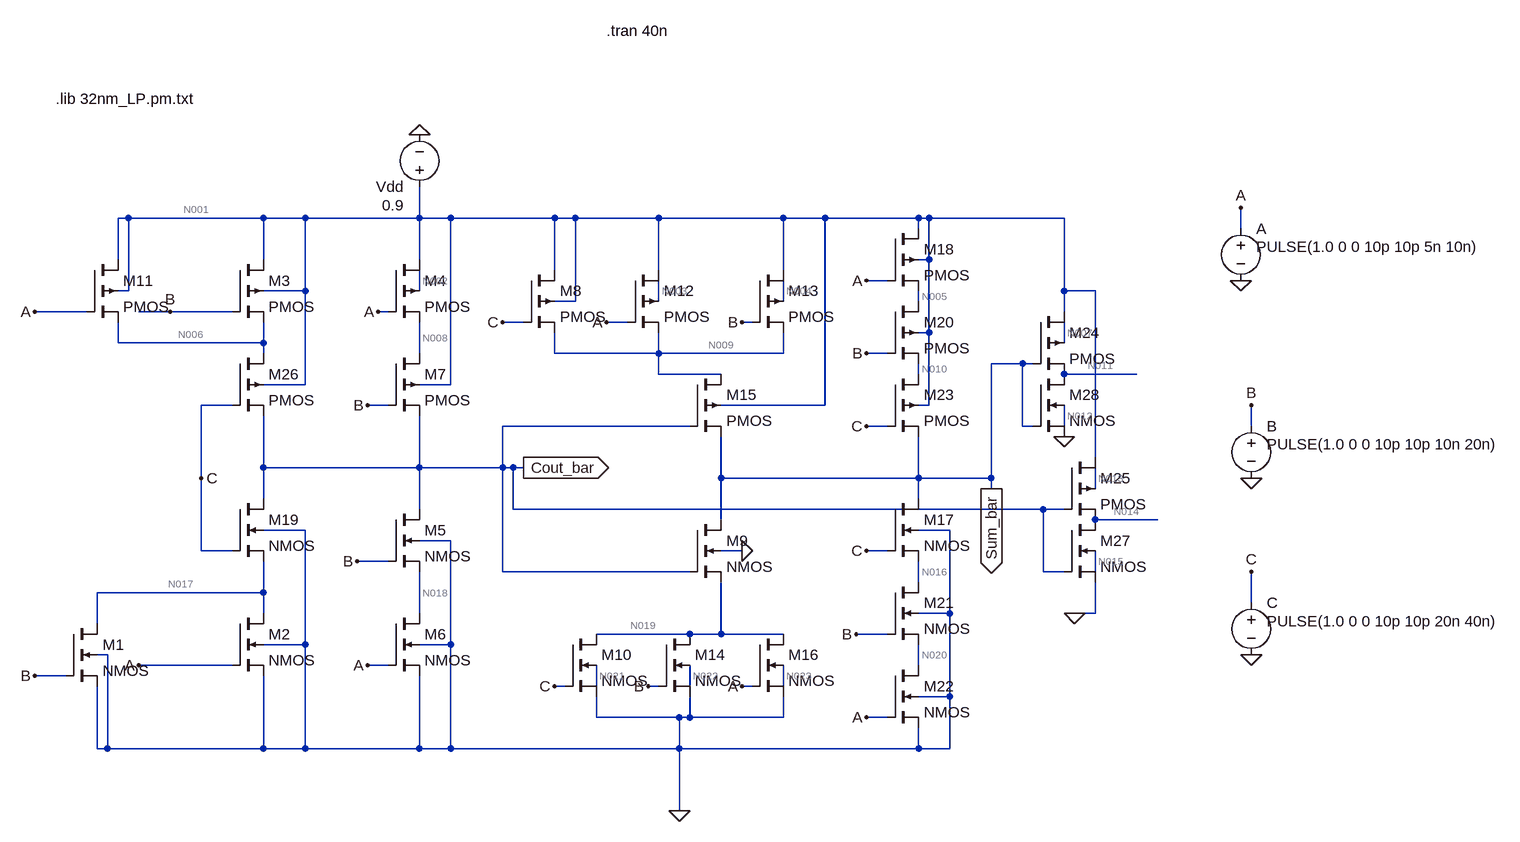
[diagram p0: schematic 28T_32nm.asc]
28T_32nm.asc, the LTspice schematic file:
Version 4
SHEET 1 1044 692
WIRE -1088 -240 -1104 -240
WIRE -880 -240 -1088 -240
WIRE -816 -240 -880 -240
WIRE -640 -240 -640 -288
WIRE -640 -240 -816 -240
WIRE -592 -240 -640 -240
WIRE -432 -240 -592 -240
WIRE -400 -240 -432 -240
WIRE -272 -240 -400 -240
WIRE -80 -240 -272 -240
WIRE -16 -240 -80 -240
WIRE 128 -240 -16 -240
WIRE 144 -240 128 -240
WIRE 352 -240 144 -240
WIRE 128 -224 128 -240
WIRE 624 -224 624 -256
WIRE -1104 -176 -1104 -240
WIRE -880 -176 -880 -240
WIRE -640 -176 -640 -240
WIRE 144 -176 144 -240
WIRE 144 -176 128 -176
WIRE -432 -160 -432 -240
WIRE -272 -160 -272 -240
WIRE -80 -160 -80 -240
WIRE 80 -144 48 -144
WIRE -1088 -128 -1088 -240
WIRE -1088 -128 -1104 -128
WIRE -816 -128 -816 -240
WIRE -816 -128 -880 -128
WIRE -640 -128 -640 -160
WIRE 352 -128 352 -240
WIRE 400 -128 352 -128
WIRE -400 -112 -400 -240
WIRE -400 -112 -432 -112
WIRE -272 -112 -272 -144
WIRE -80 -112 -80 -144
WIRE 128 -112 128 -128
WIRE -1152 -96 -1232 -96
WIRE -1024 -96 -1072 -96
WIRE -928 -96 -1024 -96
WIRE -688 -96 -704 -96
WIRE 352 -96 352 -128
WIRE -480 -80 -512 -80
WIRE -320 -80 -352 -80
WIRE -128 -80 -144 -80
WIRE 144 -64 144 -176
WIRE 144 -64 128 -64
WIRE -1104 -48 -1104 -80
WIRE -880 -48 -880 -80
WIRE -880 -48 -1104 -48
WIRE 352 -48 352 -80
WIRE -880 -32 -880 -48
WIRE -640 -32 -640 -80
WIRE -432 -32 -432 -64
WIRE -272 -32 -272 -64
WIRE -272 -32 -432 -32
WIRE -80 -32 -80 -64
WIRE -80 -32 -272 -32
WIRE 80 -32 48 -32
WIRE 288 -16 240 -16
WIRE 304 -16 288 -16
WIRE -272 0 -272 -32
WIRE -176 0 -272 0
WIRE 128 0 128 -16
WIRE 464 0 352 0
WIRE -816 16 -816 -128
WIRE -816 16 -880 16
WIRE -592 16 -592 -240
WIRE -592 16 -640 16
WIRE -928 48 -976 48
WIRE -688 48 -720 48
WIRE -16 48 -16 -240
WIRE -16 48 -176 48
WIRE 144 48 144 -64
WIRE 144 48 128 48
WIRE -224 80 -512 80
WIRE 80 80 48 80
WIRE 288 80 288 -16
WIRE 304 80 288 80
WIRE 352 80 352 48
WIRE 640 80 640 48
WIRE 400 128 400 -128
WIRE -880 144 -880 64
WIRE -640 144 -640 64
WIRE -640 144 -880 144
WIRE -512 144 -512 80
WIRE -512 144 -640 144
WIRE -496 144 -512 144
WIRE -480 144 -496 144
WIRE -976 160 -976 48
WIRE -176 160 -176 96
WIRE 128 160 128 96
WIRE 128 160 -176 160
WIRE 240 160 240 -16
WIRE 240 160 128 160
WIRE 240 176 240 160
WIRE 400 176 400 144
WIRE -880 192 -880 144
WIRE 128 192 128 160
WIRE -640 208 -640 144
WIRE -496 208 -496 144
WIRE 320 208 -496 208
WIRE 352 208 320 208
WIRE -176 224 -176 160
WIRE 496 224 400 224
WIRE -816 240 -880 240
WIRE 176 240 128 240
WIRE -592 256 -640 256
WIRE -976 272 -976 160
WIRE -928 272 -976 272
WIRE -144 272 -176 272
WIRE 80 272 48 272
WIRE -688 288 -736 288
WIRE -512 304 -512 144
WIRE -224 304 -512 304
WIRE 320 304 320 208
WIRE 352 304 320 304
WIRE 400 304 400 272
WIRE 128 320 128 288
WIRE -880 336 -880 288
WIRE -880 336 -1136 336
WIRE 640 352 640 304
WIRE -880 368 -880 336
WIRE -640 368 -640 304
WIRE 176 368 176 240
WIRE 176 368 128 368
WIRE 368 368 352 368
WIRE 400 368 400 320
WIRE 400 368 368 368
WIRE -1136 384 -1136 336
WIRE -224 400 -368 400
WIRE -176 400 -176 320
WIRE -176 400 -224 400
WIRE -80 400 -176 400
WIRE 80 400 32 400
WIRE -816 416 -816 240
WIRE -816 416 -880 416
WIRE -592 416 -592 256
WIRE -592 416 -640 416
WIRE -1120 432 -1136 432
WIRE -928 448 -1072 448
WIRE -688 448 -720 448
WIRE 128 448 128 416
WIRE -1184 464 -1232 464
WIRE -416 480 -432 480
WIRE -368 480 -368 448
WIRE -272 480 -288 480
WIRE -224 480 -224 448
WIRE -128 480 -144 480
WIRE -80 480 -80 448
WIRE 176 496 176 368
WIRE 176 496 128 496
WIRE -368 528 -368 496
WIRE -240 528 -368 528
WIRE -224 528 -224 496
WIRE -224 528 -240 528
WIRE -80 528 -80 496
WIRE -80 528 -224 528
WIRE 80 528 48 528
WIRE -1136 576 -1136 480
WIRE -1120 576 -1120 432
WIRE -1120 576 -1136 576
WIRE -880 576 -880 464
WIRE -880 576 -1120 576
WIRE -816 576 -816 416
WIRE -816 576 -880 576
WIRE -640 576 -640 464
WIRE -640 576 -816 576
WIRE -592 576 -592 416
WIRE -592 576 -640 576
WIRE -240 576 -240 528
WIRE -240 576 -592 576
WIRE 128 576 128 544
WIRE 128 576 -240 576
WIRE 176 576 176 496
WIRE 176 576 128 576
WIRE -240 672 -240 576
FLAG -240 672 0
FLAG -480 144 Cout_bar
IOPIN -480 144 Out
FLAG 240 176 Sum_bar
IOPIN 240 176 Out
FLAG 624 -144 0
FLAG 640 160 0
FLAG 640 432 0
FLAG 624 -256 A
FLAG 640 48 B
FLAG 640 304 C
FLAG -640 -368 0
FLAG -1024 -96 B
FLAG -144 -80 B
FLAG -1072 448 A
FLAG -352 -80 A
FLAG -976 160 C
FLAG 48 80 C
FLAG 48 272 C
FLAG -512 -80 C
FLAG -432 480 C
FLAG -288 480 B
FLAG -144 480 A
FLAG 48 -144 A
FLAG 48 -32 B
FLAG -1232 -96 A
FLAG -1232 464 B
FLAG -144 272 0
FLAG 32 400 B
FLAG 48 528 A
FLAG -720 48 B
FLAG -736 288 B
FLAG -704 -96 A
FLAG -720 448 A
FLAG 368 368 0
FLAG 352 96 0
SYMBOL voltage 624 -240 R0
WINDOW 3 24 44 Left 2
WINDOW 123 0 0 Left 0
WINDOW 39 0 0 Left 0
SYMATTR Value PULSE(1.0 0 0 10p 10p 5n 10n)
SYMATTR InstName A
SYMBOL voltage 640 64 R0
WINDOW 3 24 44 Left 2
WINDOW 123 0 0 Left 0
WINDOW 39 0 0 Left 0
SYMATTR Value PULSE(1.0 0 0 10p 10p 10n 20n)
SYMATTR InstName B
SYMBOL voltage 640 336 R0
WINDOW 3 24 44 Left 2
WINDOW 123 0 0 Left 0
WINDOW 39 0 0 Left 0
SYMATTR Value PULSE(1.0 0 0 10p 10p 20n 40n)
SYMATTR InstName C
SYMBOL voltage -640 -272 R180
WINDOW 3 24 -12 Left 2
WINDOW 123 0 0 Left 0
WINDOW 39 0 0 Left 0
SYMATTR Value 0.9
SYMATTR InstName Vdd
SYMBOL pmos4 -1152 -176 R0
SYMATTR InstName M11
SYMATTR Value2 l=32n w=128n
SYMBOL nmos4 -928 192 R0
SYMATTR InstName M19
SYMATTR Value2 l=32n w=64n
SYMBOL pmos4 -928 -176 R0
SYMATTR InstName M3
SYMATTR Value2 l=32n w=128n
SYMBOL pmos4 -688 -176 R0
SYMATTR InstName M4
SYMATTR Value2 l=32n w=128n
SYMBOL pmos4 -688 -32 R0
SYMATTR InstName M7
SYMATTR Value2 l=32n w=128n
SYMBOL pmos4 -480 -160 R0
SYMATTR InstName M8
SYMATTR Value2 l=32n w=128n
SYMBOL pmos4 -320 -160 R0
SYMATTR InstName M12
SYMATTR Value2 l=32n w=128n
SYMBOL pmos4 -128 -160 R0
SYMATTR InstName M13
SYMATTR Value2 l=32n w=128n
SYMBOL pmos4 -224 0 R0
SYMATTR InstName M15
SYMATTR Value2 l=32n w=128n
SYMBOL pmos4 80 -224 R0
SYMATTR InstName M18
SYMATTR Value2 l=32n w=128n
SYMBOL pmos4 80 -112 R0
SYMATTR InstName M20
SYMATTR Value2 l=32n w=128n
SYMBOL pmos4 80 0 R0
SYMATTR InstName M23
SYMATTR Value2 l=32n w=128n
SYMBOL pmos4 304 -96 R0
SYMATTR InstName M24
SYMATTR Value2 l=32n w=128n
SYMBOL pmos4 352 128 R0
SYMATTR InstName M25
SYMATTR Value2 l=32n w=128n
SYMBOL pmos4 -928 -32 R0
SYMATTR InstName M26
SYMATTR Value2 l=32n w=128n
SYMBOL nmos4 -1184 384 R0
SYMATTR InstName M1
SYMATTR Value2 l=32n w=64n
SYMBOL nmos4 -928 368 R0
SYMATTR InstName M2
SYMATTR Value2 l=32n w=64n
SYMBOL nmos4 -688 208 R0
SYMATTR InstName M5
SYMATTR Value2 l=32n w=64n
SYMBOL nmos4 -688 368 R0
SYMATTR InstName M6
SYMATTR Value2 l=32n w=64n
SYMBOL nmos4 -224 224 R0
SYMATTR InstName M9
SYMATTR Value2 l=32n w=64n
SYMBOL nmos4 -416 400 R0
SYMATTR InstName M10
SYMATTR Value2 l=32n w=64n
SYMBOL nmos4 -272 400 R0
SYMATTR InstName M14
SYMATTR Value2 l=32n w=64n
SYMBOL nmos4 -128 400 R0
SYMATTR InstName M16
SYMATTR Value2 l=32n w=64n
SYMBOL nmos4 80 192 R0
SYMATTR InstName M17
SYMATTR Value2 l=32n w=64n
SYMBOL nmos4 80 320 R0
SYMATTR InstName M21
SYMATTR Value2 l=32n w=64n
SYMBOL nmos4 80 448 R0
SYMATTR InstName M22
SYMATTR Value2 l=32n w=64n
SYMBOL nmos4 352 224 R0
SYMATTR InstName M27
SYMATTR Value2 l=32n w=64n
SYMBOL nmos4 304 0 R0
SYMATTR InstName M28
SYMATTR Value2 l=32n w=64n
TEXT -1200 -424 Left 2 !.lib 32nm_LP.pm.txt
TEXT -352 -528 Left 2 !.tran 40n

The netlist it stands for:
* 28T_32nm.asc
V§A A 0 PULSE(1.0 0 0 10p 10p 5n 10n)
V§B B 0 PULSE(1.0 0 0 10p 10p 10n 20n)
V§C C 0 PULSE(1.0 0 0 10p 10p 20n 40n)
Vdd N001 0 0.9
M11 N001 A N006 N001 PMOS l=32n w=128n
M19 Cout_bar C N017 0 NMOS l=32n w=64n
M3 N001 B N006 N001 PMOS l=32n w=128n
M4 N001 A N008 N002 PMOS l=32n w=128n
M7 N008 B Cout_bar N001 PMOS l=32n w=128n
M8 N001 C N009 N001 PMOS l=32n w=128n
M12 N001 A N009 N003 PMOS l=32n w=128n
M13 N001 B N009 N004 PMOS l=32n w=128n
M15 N009 Cout_bar Sum_bar N001 PMOS l=32n w=128n
M18 N001 A N005 N001 PMOS l=32n w=128n
M20 N005 B N010 N001 PMOS l=32n w=128n
M23 N010 C Sum_bar N001 PMOS l=32n w=128n
M24 N001 Sum_bar N011 N007 PMOS l=32n w=128n
M25 N001 Cout_bar N014 N013 PMOS l=32n w=128n
M26 N006 C Cout_bar N001 PMOS l=32n w=128n
M1 N017 B 0 0 NMOS l=32n w=64n
M2 N017 A 0 0 NMOS l=32n w=64n
M5 Cout_bar B N018 0 NMOS l=32n w=64n
M6 N018 A 0 0 NMOS l=32n w=64n
M9 Sum_bar Cout_bar N019 0 NMOS l=32n w=64n
M10 N019 C 0 N021 NMOS l=32n w=64n
M14 N019 B 0 N022 NMOS l=32n w=64n
M16 N019 A 0 N023 NMOS l=32n w=64n
M17 Sum_bar C N016 0 NMOS l=32n w=64n
M21 N016 B N020 0 NMOS l=32n w=64n
M22 N020 A 0 0 NMOS l=32n w=64n
M27 N014 Cout_bar 0 N015 NMOS l=32n w=64n
M28 N011 Sum_bar 0 N012 NMOS l=32n w=64n
.model NMOS NMOS
.model PMOS PMOS
.lib standard.mos
.lib 32nm_LP.pm.txt
.tran 40n
.backanno
.end

* Results of the author's LTspice run, read from the files saved beside the schematic
* Operating Point, zero values left out:
*   V(a) = 1 V
*   V(b) = 1 V
*   V(c) = 1 V
*   V(n001) = 900 mV
*   V(n006) = 794.3 mV
*   V(cout_bar) = 437.6 nV
*   V(n017) = 248.9 nV
*   V(n008) = 794.4 mV
*   V(n002) = 790.6 mV
*   V(n009) = 209 mV
*   V(n003) = 775.6 mV
*   V(n004) = 775.6 mV
*   V(sum_bar) = 3.305 µV
*   V(n005) = 875.9 mV
*   V(n010) = 768.3 mV
*   V(n011) = 899.9 mV
*   V(n007) = 765.7 mV
*   V(n014) = 899.9 mV
*   V(n013) = 765.7 mV
*   V(n018) = 321.8 nV
*   V(n019) = 120.1 nV
*   V(n021) = 164.8 mV
*   V(n022) = 164.8 mV
*   V(n023) = 164.8 mV
*   V(n016) = 2.409 µV
*   V(n020) = 1.308 µV
*   V(n015) = 256.2 mV
*   V(n012) = 256.2 mV
*   Id(M28) = 15.24 nA
*   Ig(M28) = -21.64 pA
*   Is(M28) = -15.22 nA
*   Id(M27) = 15.24 nA
*   Ig(M27) = -21.64 pA
*   Is(M27) = -15.21 nA
*   Id(M22) = 346 pA
*   Ig(M22) = 66.86 pA
*   Ib(M22) = -7.698 pA
*   Is(M22) = -405.1 pA
*   Id(M21) = 286.8 pA
*   Ig(M21) = 66.86 pA
*   Ib(M21) = -7.698 pA
*   Is(M21) = -346 pA
*   Id(M17) = 227.7 pA
*   Ig(M17) = 66.86 pA
*   Ib(M17) = -7.698 pA
*   Is(M17) = -286.8 pA
*   Ig(M16) = 65.44 pA
*   Is(M16) = -65.27 pA
*   Ig(M14) = 65.44 pA
*   Is(M14) = -65.27 pA
*   Ig(M10) = 65.44 pA
*   Is(M10) = -65.27 pA
*   Id(M6) = 62.84 pA
*   Ig(M6) = 66.86 pA
*   Ib(M6) = -7.698 pA
*   Is(M6) = -122 pA
*   Id(M5) = 3.681 pA
*   Ig(M5) = 66.86 pA
*   Ib(M5) = -7.698 pA
*   Is(M5) = -62.84 pA
*   Id(M2) = 41.9 pA
*   Ig(M2) = 66.86 pA
*   Ib(M2) = -7.698 pA
*   Is(M2) = -101.1 pA
*   Id(M1) = 41.9 pA
*   Ig(M1) = 66.86 pA
*   Ib(M1) = -7.698 pA
*   Is(M1) = -101.1 pA
*   Id(M19) = 24.63 pA
*   Ig(M19) = 66.86 pA
*   Ib(M19) = -7.698 pA
*   Is(M19) = -83.79 pA
*   Id(M26) = 1.661 pA
*   Ib(M26) = 1.015 pA
*   Is(M26) = -2.681 pA
*   Id(M25) = 15.24 nA
*   Ig(M25) = -1.297 pA
*   Is(M25) = -15.24 nA
*   Id(M24) = 15.24 nA
*   Ig(M24) = -1.297 pA
*   Is(M24) = -15.24 nA
*   Ib(M23) = 1.042 pA
*   Is(M23) = -1.493 pA
*   Id(M15) = 201.6 pA
*   Ib(M15) = 1.604 pA
*   Is(M15) = -203.2 pA
*   Id(M13) = 84.12 pA
*   Is(M13) = -83.34 pA
*   Id(M12) = 84.12 pA
*   Is(M12) = -83.34 pA
*   Id(M8) = 34.24 pA
*   Is(M8) = -34.94 pA
*   Id(M7) = 1.664 pA
*   Ib(M7) = 1.015 pA
*   Is(M7) = -2.684 pA
*   Id(M4) = 2.454 pA
*   Is(M4) = -1.664 pA
*   I(Vdd) = -30.69 nA
*   I(C) = -199.2 pA
*   I(B) = -266 pA
*   I(A) = -266 pA
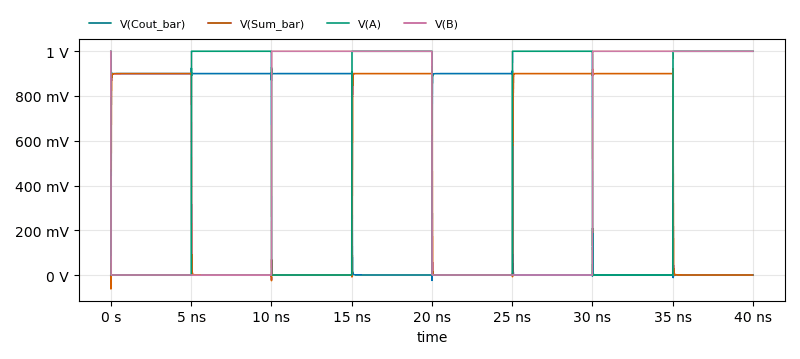
[diagram p1: Transient Analysis of 28T_32nm.asc, plotted from the saved traces]
* Transient Analysis, 1 run:
*   V(Cout_bar): min -52.98 mV, max 925.4 mV, average 450.9 mV, rms 636.6 mV, last 7.591 µV
*   V(Sum_bar): min -61.79 mV, max 920.1 mV, average 449.6 mV, rms 635.3 mV, last 35.44 µV
*   V(A): min 0 V, max 1 V, average 499 mV, rms 706.2 mV, last 1 V
*   V(B): min 0 V, max 1 V, average 499.5 mV, rms 706.6 mV, last 1 V